# Altium schematic sheet Output.SchDoc
size A3; SheetNumber: 6; SheetTotal: 6; SPICEModelCacheDUFQVYXA: <root> / <DocumentId>DUFQVYXA</DocumentId> / <CacheFrame Number="0"> / <Model Name="cap" Kind="MDL"> / <Text>*Default semiconductor capacitor / .MODEL CAP C()</Text> / </Model> / </CacheFrame> / </root>
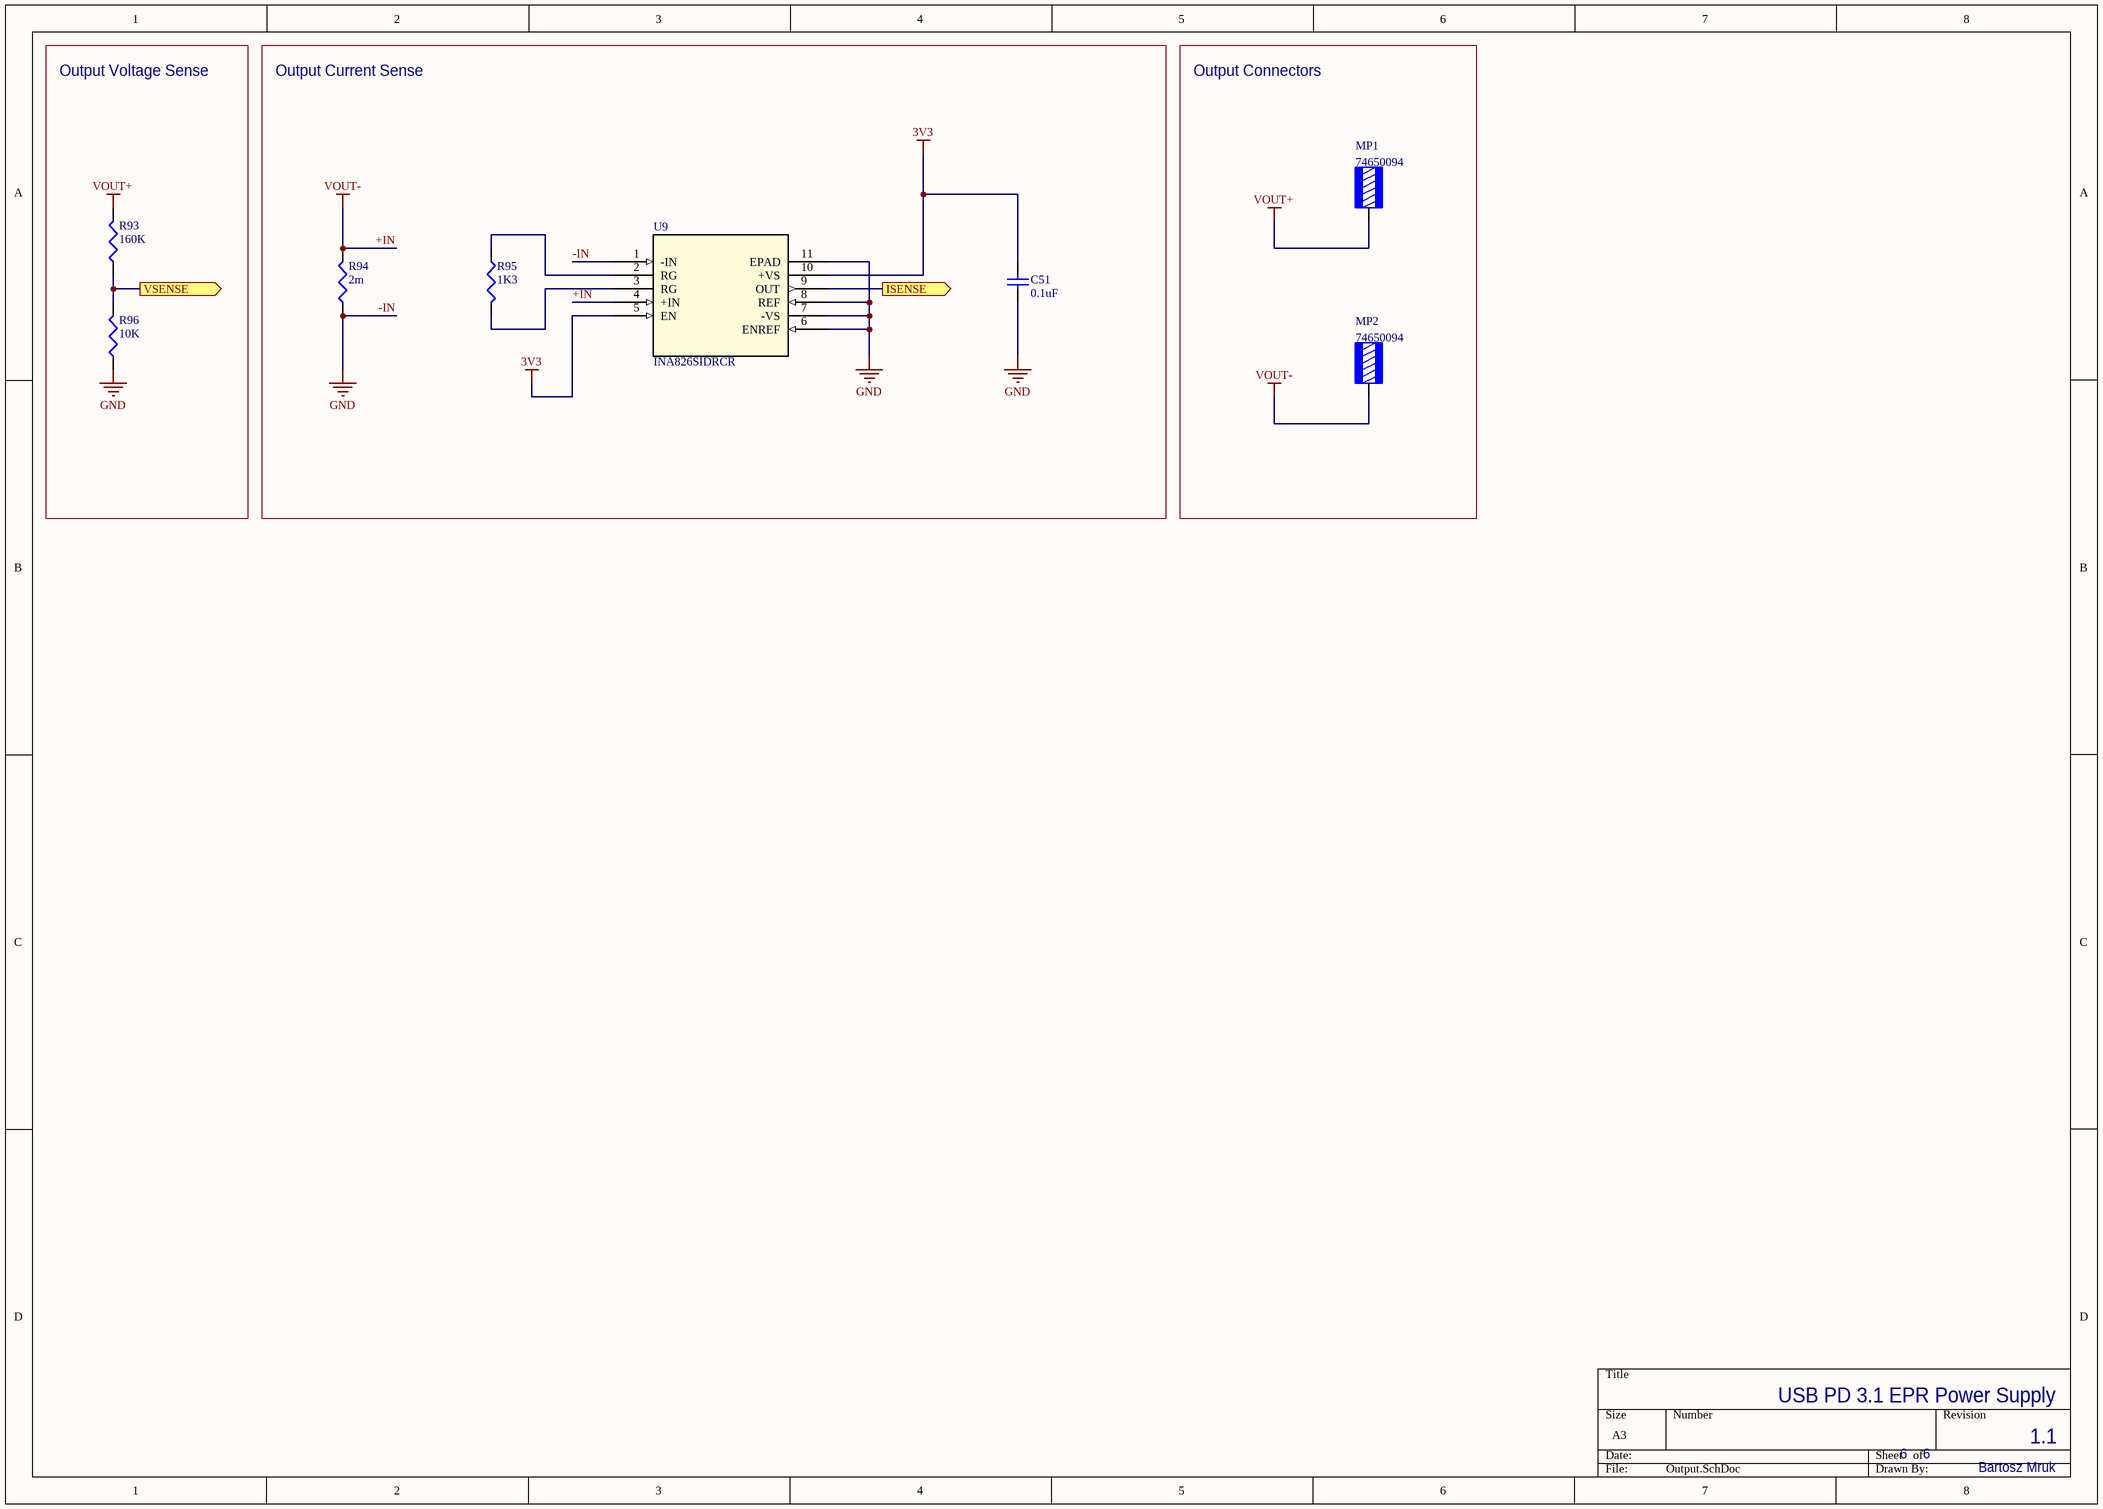
[diagram p0: Output.SchDoc]

## Parts
C51  value 0.1uF  [1608[0603]]
MP1  74650094  [74650094]
MP2  74650094  [74650094]
R93  value 160K  [J1-0603]  (hidden comment: Res3)
R94  value 2m  [RESC6332]  (hidden comment: Res3)
R95  value 1K3  [J1-0603]  (hidden comment: Res3)
R96  value 10K  [J1-0603]  (hidden comment: Res3)
U9  INA826SIDRCR  [DRC10_TEX]

## Blocks framed on the sheet
Output Voltage Sense: R93 R96
Output Current Sense: C51 R94 R95 U9
Output Connectors: MP1 MP2

## Ports
ISENSE (out), VSENSE (out)

## Nets
3V3: C51.2 U9.5(EN) U9.10(+VS)
+IN: MP2.1 R94.2 U9.4(+IN)  [also labelled VOUT-]
-IN: C51.1 R94.1 R96.1 U9.1(-IN) U9.6(ENREF) U9.7(-VS) U9.8(REF) U9.11(EPAD)  [also labelled GND]
VOUT+: MP1.1 R93.2
ISENSE: U9.9(OUT) ; port ISENSE
VSENSE: R93.1 R96.2 ; port VSENSE
NetR95_1: R95.1 U9.2(RG)
NetR95_2: R95.2 U9.3(RG)

## Notes on the sheet
- 6
- 1.1
- USB PD 3.1 EPR Power Supply
- Bartosz Mruk

## Library data of the parts
C51 = Cap Semi: Capacitor (Semiconductor SIM Model); Published: 8-Jun-2000; LatestRevisionDate: 29-May-2009; LatestRevisionNote: IPC-7351 Footprint Added.; PackageReference: C1206; Publisher: Altium Limited; PackageDescription: Chip Capacitor
MP1 MP2 = CMP-03913-89699612-2: WP-THRBU REDCUBE Bush, THR_open; Current Rating: 85A; Packaging: Bulk; Min Operating Temperature: -55°C; Number of Pins: 8; Height: 3mm; RoHS: Compliant; Width: 10mm; Max Operating Temperature: 150°C; Material: Brass
R93-R96 = Res3: Resistor; Published: 8-Jun-2000; LatestRevisionDate: 29-May-2009; LatestRevisionNote: IPC-7351 Footprint Added.; PackageReference: J1-0603; Publisher: Altium Limited; PackageDescription: Chip Resistor
U9 = INA826SIDRCR: 200 Î¼A, 36V, Rail-to-Rail Out Instrumentation Amplifier with Shutdown 10-VSON -40 to 125; Manufacturer_Name: Texas Instruments; Copyright: Copyright (C) 2025 Ultra Librarian. All rights reserved.; Manufacturer_Part_Number: INA826SIDRCR; Datasheet: https://www.ti.com/lit/gpn/ina826s; RefDes: RefDes; Type: Type